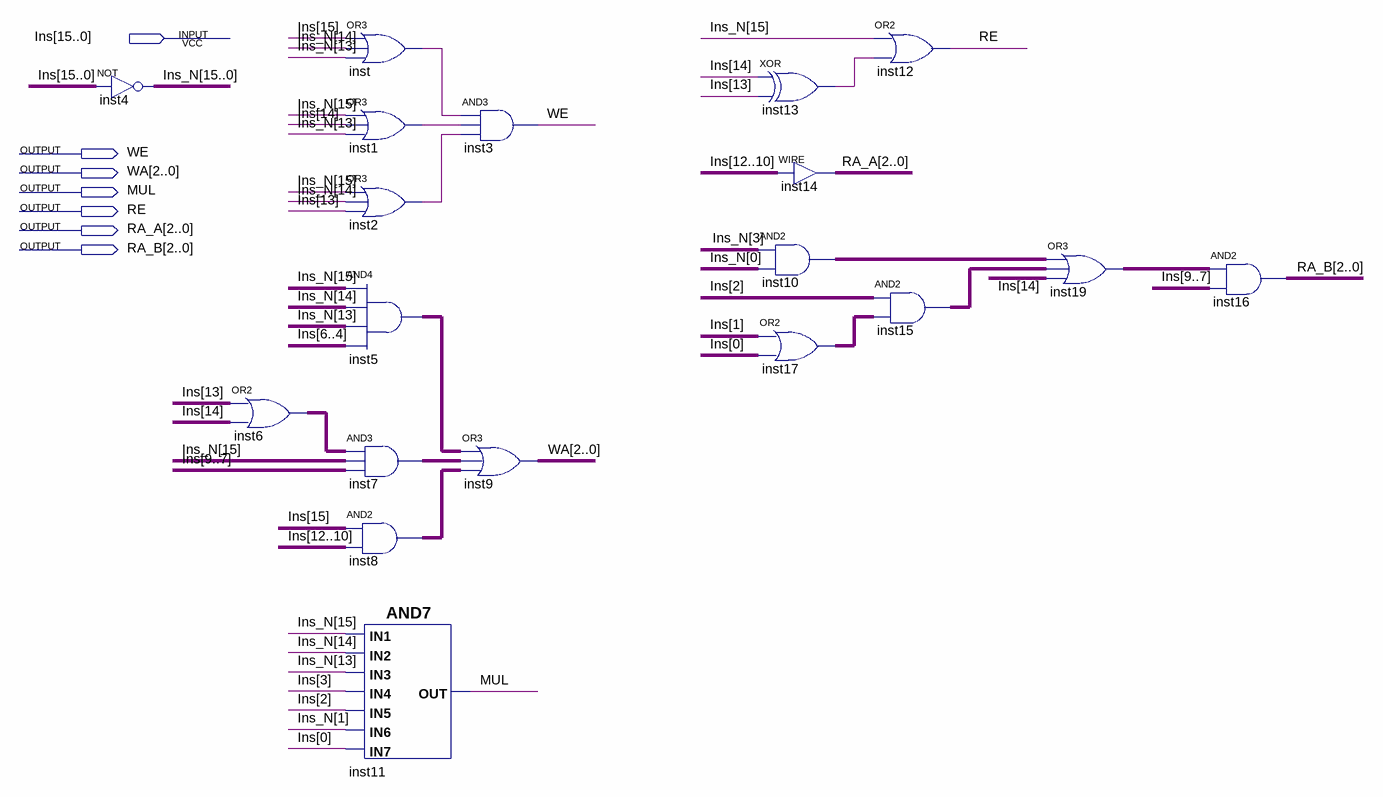
[diagram p0: schematic sheet]
// Quartus schematic Reg_Define.bdf as structural Verilog: 19 symbols, 7 pins
module Reg_Define (
  input  [15:0] Ins,
  output WE,
  output [2:0] WA,
  output MUL,
  output RE,
  output [2:0] RA_A,
  output [2:0] RA_B
);

  wire inst1_out, inst2_out, inst13_out, inst_out;
  wire [2:0] inst5_out, inst6_out, inst7_out, inst8_out, inst10_out, inst15_out, inst17_out, inst19_out;
  wire [15:0] Ins_N;

  assign Ins_N = ~Ins;  // NOT inst4, 16 bits wide
  assign inst6_out = {3{Ins[13]}} | {3{Ins[14]}};  // OR2 inst6, 3 bits wide
  or inst (inst_out, Ins[15], Ins_N[14], Ins_N[13]);
  or inst1 (inst1_out, Ins_N[15], Ins[14], Ins_N[13]);
  or inst2 (inst2_out, Ins_N[15], Ins_N[14], Ins[13]);
  assign inst5_out = {3{Ins_N[15]}} & {3{Ins_N[14]}} & {3{Ins_N[13]}} & Ins[6:4];  // AND4 inst5, 3 bits wide
  assign inst7_out = inst6_out & {3{Ins_N[15]}} & Ins[9:7];  // AND3 inst7, 3 bits wide
  assign inst8_out = {3{Ins[15]}} & Ins[12:10];  // AND2 inst8, 3 bits wide
  and inst11 (MUL, Ins_N[15], Ins_N[14], Ins_N[13], Ins[3], Ins[2], Ins_N[1], Ins[0]);
  and inst3 (WE, inst_out, inst1_out, inst2_out);
  assign WA = inst5_out | inst7_out | inst8_out;  // OR3 inst9, 3 bits wide
  xor inst13 (inst13_out, Ins[14], Ins[13]);
  assign RA_A = Ins[12:10];  // WIRE inst14
  assign inst10_out = {3{Ins_N[3]}} & {3{Ins_N[0]}};  // AND2 inst10, 3 bits wide
  assign inst17_out = {3{Ins[1]}} | {3{Ins[0]}};  // OR2 inst17, 3 bits wide
  or inst12 (RE, Ins_N[15], inst13_out);
  assign inst15_out = {3{Ins[2]}} & inst17_out;  // AND2 inst15, 3 bits wide
  assign inst19_out = inst10_out | inst15_out | {3{Ins[14]}};  // OR3 inst19, 3 bits wide
  assign RA_B = inst19_out & Ins[9:7];  // AND2 inst16, 3 bits wide
endmodule
